# Altium schematic sheet CL05A225MQ5NSNC1_CL05A225MQ5NSNC.schdoc
size 124 x 99 mm
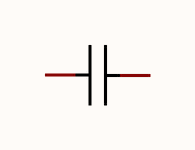
[diagram p0: CL05A225MQ5NSNC1_CL05A225MQ5NSNC.schdoc]

## Parts
C?  2.2uF  [C0402]  (value not drawn)

## Nets

Not connected (* = marked no-connect by the designer): C? 1 2

## Library data of the parts
C? = CL05A225MQ5NSNC: Manufacturer: SAMSUNG(三星); Add into BOM: yes; Tolerance: ±20%; Voltage Rated: 6.3V; Temperature Coefficient: X5R; Symbol: CL05A225MQ5NSNC; Device: CL05A225MQ5NSNC; LCSC Part Name: 2.2uF ±20% 6.3V; Supplier Part: C12530; Manufacturer Part: CL05A225MQ5NSNC; Supplier Footprint: 0402; JLCPCB Part Class: Basic Part; Datasheet: https://atta.szlcsc.com/upload/public/pdf/source/20160218/1457707763339.pdf; Supplier: LCSC; Convert to PCB: yes; Value: 2.2uF